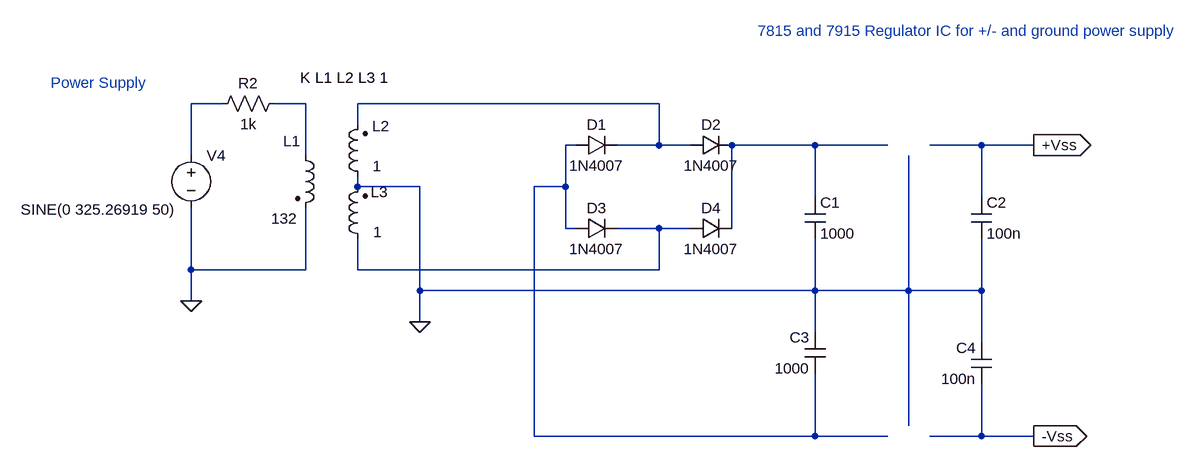
[diagram p0: schematic power_supply.asc]
power_supply.asc, the LTspice schematic file:
Version 4
SHEET 1 1500 3368
WIRE -432 2784 -480 2784
WIRE -304 2784 -352 2784
WIRE 240 2784 -224 2784
WIRE -224 2816 -224 2784
WIRE 112 2848 96 2848
WIRE 240 2848 240 2784
WIRE 240 2848 176 2848
WIRE 288 2848 240 2848
WIRE 480 2848 352 2848
WIRE 592 2848 480 2848
WIRE 736 2848 656 2848
WIRE 816 2848 736 2848
WIRE -480 2864 -480 2784
WIRE -304 2864 -304 2784
WIRE -224 2912 -224 2896
WIRE -128 2912 -224 2912
WIRE 96 2912 96 2848
WIRE 96 2912 48 2912
WIRE 480 2928 480 2848
WIRE 736 2928 736 2848
WIRE 96 2976 96 2912
WIRE 112 2976 96 2976
WIRE 240 2976 176 2976
WIRE 288 2976 240 2976
WIRE 352 2976 352 2848
WIRE -480 3040 -480 2944
WIRE -304 3040 -304 2944
WIRE -304 3040 -480 3040
WIRE -224 3040 -224 2992
WIRE 240 3040 240 2976
WIRE 240 3040 -224 3040
WIRE -128 3072 -128 2912
WIRE 480 3072 480 2992
WIRE 480 3072 -128 3072
WIRE 624 3072 624 2864
WIRE 624 3072 480 3072
WIRE 736 3072 736 2992
WIRE 736 3072 624 3072
WIRE -480 3088 -480 3040
WIRE -128 3120 -128 3072
WIRE 480 3136 480 3072
WIRE 736 3152 736 3072
WIRE 624 3280 624 3072
WIRE 48 3296 48 2912
WIRE 480 3296 480 3200
WIRE 480 3296 48 3296
WIRE 592 3296 480 3296
WIRE 736 3296 736 3216
WIRE 736 3296 656 3296
WIRE 816 3296 736 3296
FLAG -480 3088 0
FLAG -128 3120 0
FLAG 816 2848 +Vss
IOPIN 816 2848 Out
FLAG 816 3296 -Vss
IOPIN 816 3296 Out
SYMBOL voltage -480 2848 R0
WINDOW 3 -262 99 Left 2
WINDOW 123 0 0 Left 0
WINDOW 39 0 0 Left 0
SYMATTR Value SINE(0 325.26919 50)
SYMATTR InstName V4
SYMBOL ind2 -320 2848 R0
WINDOW 0 -18 -6 Left 2
WINDOW 3 -37 113 Left 2
SYMATTR InstName L1
SYMATTR Value 132
SYMATTR Type ind
SYMBOL ind2 -208 2912 R180
WINDOW 0 -34 93 Left 2
WINDOW 3 -21 32 Left 2
SYMATTR InstName L2
SYMATTR Value 1
SYMATTR Type ind
SYMBOL res -336 2768 R90
WINDOW 0 0 56 VBottom 2
WINDOW 3 32 56 VTop 2
SYMATTR InstName R2
SYMATTR Value 1k
SYMBOL diode 112 2864 R270
WINDOW 0 32 32 VTop 2
WINDOW 3 0 32 VBottom 2
SYMATTR InstName D1
SYMATTR Value 1N4007
SYMBOL diode 288 2864 R270
WINDOW 0 32 32 VTop 2
WINDOW 3 0 32 VBottom 2
SYMATTR InstName D2
SYMATTR Value 1N4007
SYMBOL diode 112 2992 R270
WINDOW 0 32 32 VTop 2
WINDOW 3 0 32 VBottom 2
SYMATTR InstName D3
SYMATTR Value 1N4007
SYMBOL diode 288 2992 R270
WINDOW 0 32 32 VTop 2
WINDOW 3 0 32 VBottom 2
SYMATTR InstName D4
SYMATTR Value 1N4007
SYMBOL cap 464 2928 R0
SYMATTR InstName C1
SYMATTR Value 1000
SYMBOL cap 720 2928 R0
SYMATTR InstName C2
SYMATTR Value 100n
SYMBOL ind2 -208 3008 R180
WINDOW 0 -31 88 Left 2
WINDOW 3 -22 26 Left 2
SYMATTR InstName L3
SYMATTR Value 1
SYMATTR Type ind
SYMBOL cap 496 3136 M0
SYMATTR InstName C3
SYMATTR Value 1000
SYMBOL cap 752 3152 M0
SYMATTR InstName C4
SYMATTR Value 100n
TEXT -696 2752 Left 2 ;Power Supply
TEXT -312 2744 Left 2 !K L1 L2 L3 1
TEXT 392 2672 Left 2 ;7815 and 7915 Regulator IC for +/- and ground power supply

The netlist it stands for:
* power_supply.asc
V4 N001 0 SINE(0 325.26919 50)
L1 N002 0 132
L2 0 N003 1
R2 N002 N001 1k
D1 N004 N003 1N4007
D2 N003 N005 1N4007
D3 N004 N006 1N4007
D4 N006 N005 1N4007
C1 N005 0 1000
C2 +Vss 0 100n
L3 N006 0 1
C3 0 N004 1000
C4 0 -Vss 100n
.model D D
.lib standard.dio
* Power Supply
K L1 L2 L3 1
* 7815 and 7915 Regulator IC for +/- and ground power supply
.backanno
.end